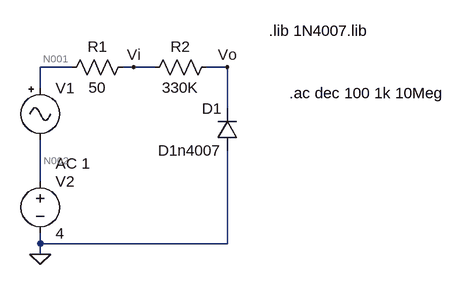
[diagram p0: schematic Sim_Ej3.asc]
Sim_Ej3.asc, the LTspice schematic file:
Version 4
SHEET 1 880 680
WIRE 96 80 48 80
WIRE 192 80 176 80
WIRE 224 80 192 80
WIRE 336 80 304 80
WIRE 48 112 48 80
WIRE 336 144 336 80
WIRE 48 256 48 192
WIRE 48 352 48 336
WIRE 336 352 336 208
WIRE 336 352 48 352
WIRE 48 368 48 352
FLAG 48 368 0
FLAG 336 80 Vo
FLAG 192 80 Vi
SYMBOL res 192 64 R90
WINDOW 0 0 56 VBottom 2
WINDOW 3 32 56 VTop 2
SYMATTR InstName R1
SYMATTR Value 50
SYMBOL res 320 64 R90
WINDOW 0 0 56 VBottom 2
WINDOW 3 32 56 VTop 2
SYMATTR InstName R2
SYMATTR Value 330K
SYMBOL diode 352 208 R180
WINDOW 0 24 64 Left 2
WINDOW 3 24 0 Left 2
SYMATTR InstName D1
SYMATTR Value D1n4007
SYMBOL Misc\\signal 48 96 R0
WINDOW 123 24 132 Left 2
WINDOW 39 0 0 Left 2
SYMATTR Value2 AC 1
SYMATTR InstName V1
SYMATTR Value ""
SYMBOL voltage 48 240 R0
WINDOW 123 0 0 Left 2
WINDOW 39 0 0 Left 2
SYMATTR InstName V2
SYMATTR Value 4
TEXT 400 24 Left 2 !.lib 1N4007.lib
TEXT 432 120 Left 2 !.ac dec 100 1k 10Meg

The netlist it stands for:
* Sim_Ej3.asc
R1 Vi N001 50
R2 Vo Vi 330K
D1 0 Vo D1n4007
V1 N001 N002 AC 1
V2 N002 0 4
.model D D
.lib standard.dio
.lib 1N4007.lib
.ac dec 100 1k 10Meg
.backanno
.end

* Results of the author's LTspice run, read from the files saved beside the schematic
* Operating Point, zero values left out:
*   V(vi) = 4 V
*   V(n001) = 4 V
*   V(vo) = 3.998 V
*   V(n002) = 4 V
*   I(D1) = -7.032 nA
*   I(R2) = -7.032 nA
*   I(R1) = -7.032 nA
*   I(V2) = -7.032 nA
*   I(V1) = -7.032 nA
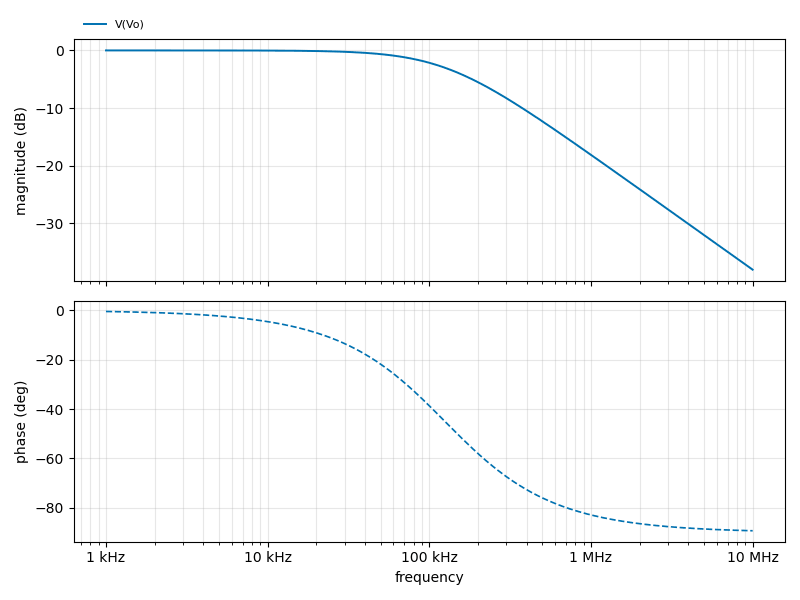
[diagram p1: AC Analysis of Sim_Ej3.asc, plotted from the saved traces]
* AC Analysis, 1 run:
*   V(Vo): -0.00 dB at 1 kHz, -38.07 dB at 10 MHz, peak -0.00 dB at 1 kHz, 3 dB below the peak at 124.9 kHz